# EAGLE design RCJ_com_v2 (EAGLE 9.6.2)
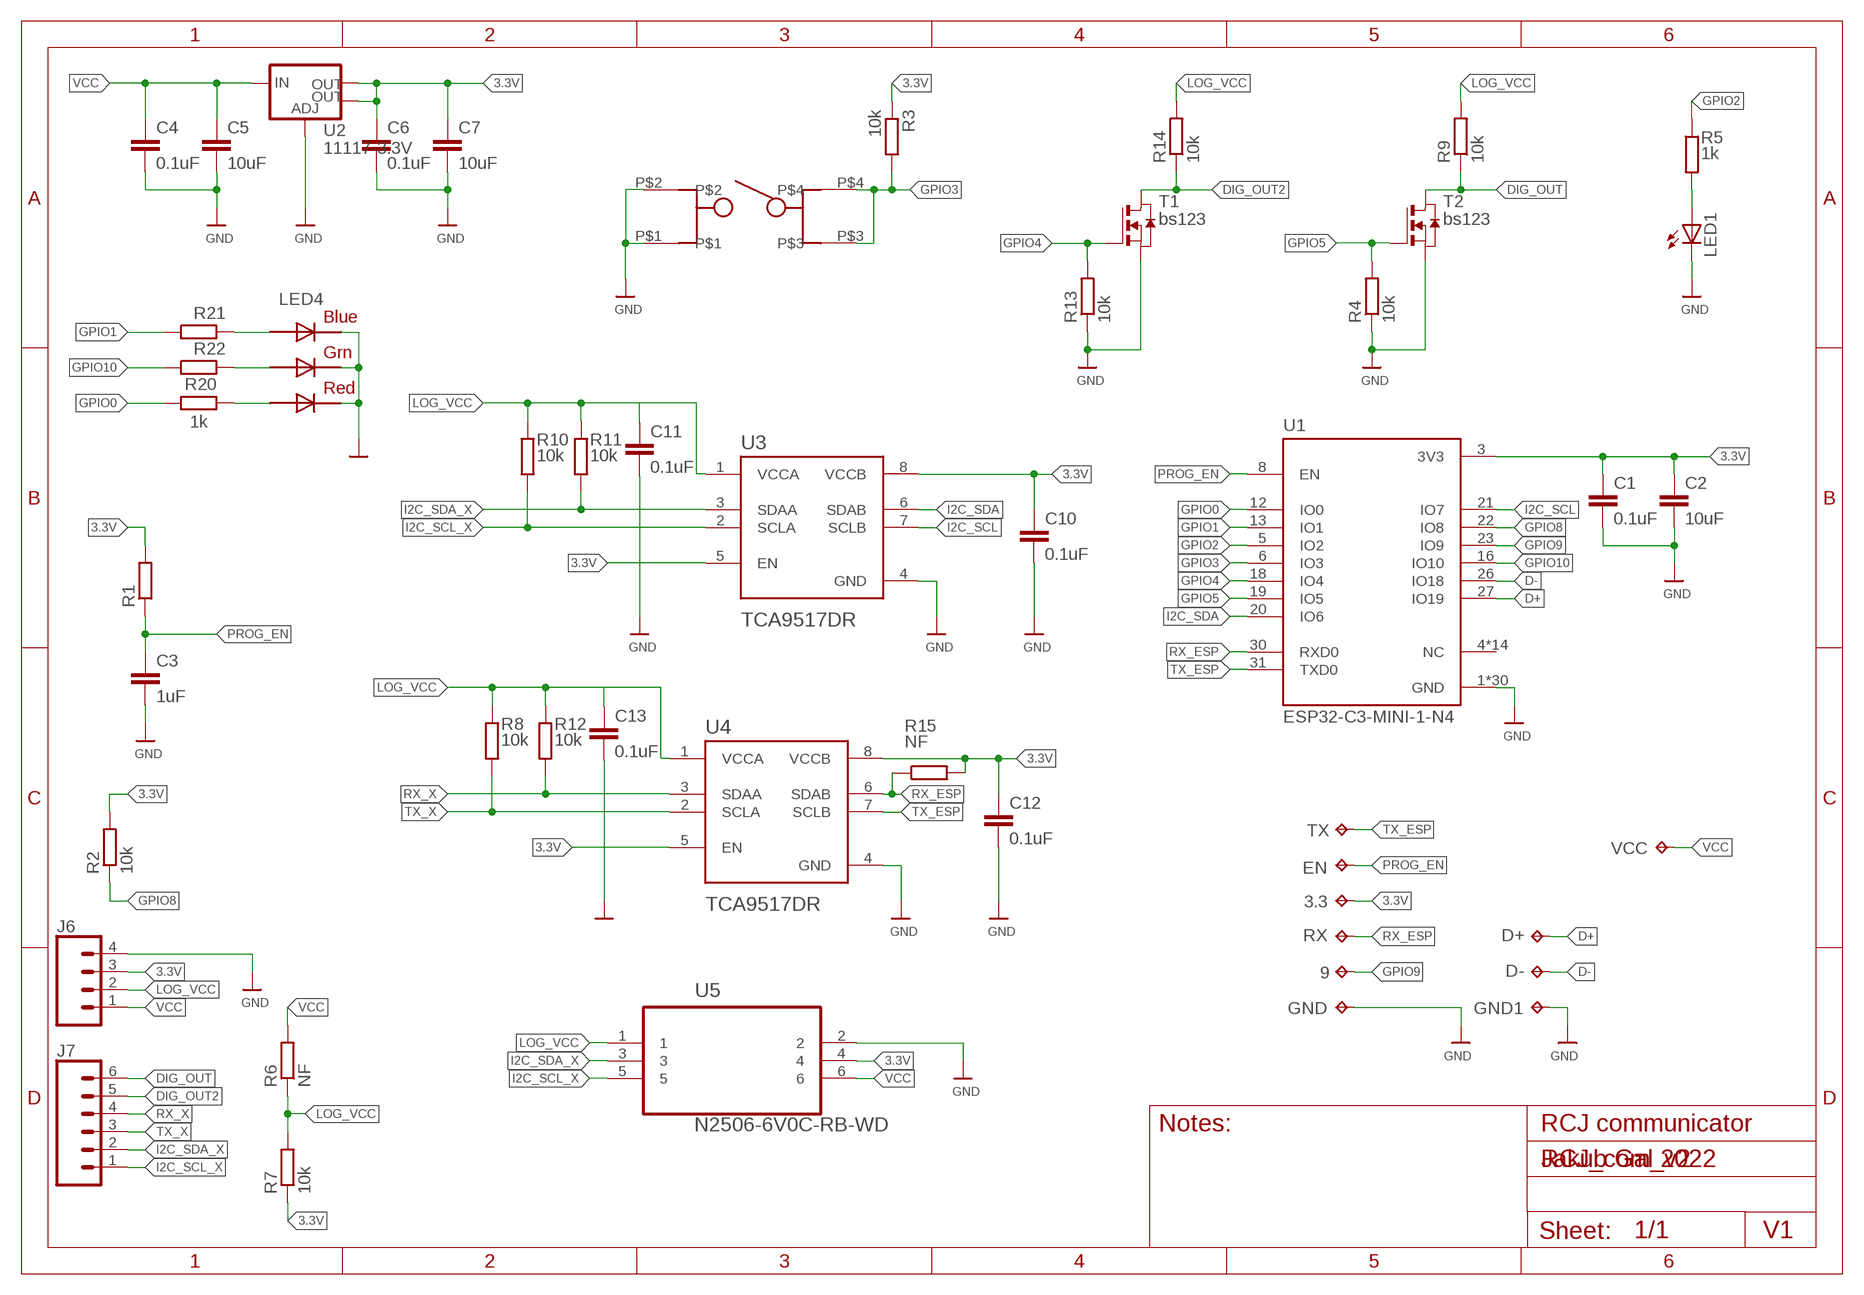
[diagram p0: schematic, sheet 1]

## Parts
3.3  TPTP08R  [TP08R]
9  TPTP08R  [TP08R]
C1  0.1uF  C-EUC0402K  [C0402K]
C2  10uF  C-EUC0402K  [C0402K]
C3  1uF  C-EUC0402K  [C0402K]
C4  0.1uF  C-EUC0402K  [C0402K]
C5  10uF  C-EUC0402K  [C0402K]
C6  0.1uF  C-EUC0402K  [C0402K]
C7  10uF  C-EUC0402K  [C0402K]
C10  0.1uF  C-EUC0402K  [C0402K]
C11  0.1uF  C-EUC0402K  [C0402K]
C12  0.1uF  C-EUC0402K  [C0402K]
C13  0.1uF  C-EUC0402K  [C0402K]
D+  TPTP08R  [TP08R]
D-  TPTP08R  [TP08R]
EN  TPTP08R  [TP08R]
GND  TPTP08R  [TP08R]
GND1  TPTP08R  [TP08R]
J6  CONN_04  [1X04]
J7  CONN_06SILK_FEMALE_PTH  [1X06]
LED1  0603_Led  LEDCHIPLED_0603  [CHIPLED_0603]
LED4  RGBLED5050  [RGBLED5050]
R1  10k  R-EU_R0402  [R0402]
R2  10k  R-EU_R0402  [R0402]
R3  10k  R-EU_R0402  [R0402]
R4  10k  R-EU_R0402  [R0402]
R5  1k  R-EU_R0402  [R0402]
R6  NF  R-EU_R0402  [R0402]
R7  10k  R-EU_R0402  [R0402]
R8  10k  R-EU_R0402  [R0402]
R9  10k  R-EU_R0402  [R0402]
R10  10k  R-EU_R0402  [R0402]
R11  10k  R-EU_R0402  [R0402]
R12  10k  R-EU_R0402  [R0402]
R13  10k  R-EU_R0402  [R0402]
R14  10k  R-EU_R0402  [R0402]
R15  NF  R-EU_R0402  [R0402]
R20  1k  R-EU_R0402  [R0402]
R21  1k  R-EU_R0402  [R0402]
R22  1k  R-EU_R0402  [R0402]
RX  TPTP08R  [TP08R]
T1  bs123  NMOSSOT23  [SOT-23]
T2  bs123  NMOSSOT23  [SOT-23]
TX  TPTP08R  [TP08R]
U1  ESP32-C3-MINI-1-N4  [XCVR_ESP32-C3-MINI-1-N4]
U2  11117-3.3V  V_REG_LM1117SOT223  [SOT223]
U3  TCA9517DR  [SOIC127P599X175-8N]
U4  TCA9517DR  [SOIC127P599X175-8N]
U5  N2506-6V0C-RB-WD  [3M_N2506-6V0C-RB-WD]
U$9  BUTON  [PBUTON_LSCS]
VCC  TPTP08R  [TP08R]

## Nets
3.3V: 3.3.TP C1.1 C2.1 C6.1 C7.1 C10.1 C12.1 J6.3 R1.2 R2.2 R3.1 R7.1 R15.2 U1.3(3V3) U2.2(OUT) U2.4(OUT) U3.5(EN) U3.8(VCCB) U4.5(EN) U4.8(VCCB) U5.4
D+: D+.TP U1.27(IO19)
D-: D-.TP U1.26(IO18)
DIG_OUT: J7.6 R9.1 T2.1(D)
DIG_OUT2: J7.5 R14.1 T1.1(D)
GND: C1.2 C2.2 C3.2 C4.2 C5.2 C6.2 C7.2 C10.2 C11.2 C12.2 C13.2 GND1.TP GND.TP J6.4 LED1.C LED4.4(BLUE_C) LED4.5(RED_C) LED4.6(GREEN_C) R4.1 R13.1 T1.2(S) T2.2(S) U1.1(GND) U1.2(GND) U1.11(GND) U1.14(GND) U1.36(GND) U1.37(GND) U1.38(GND) U1.39(GND) U1.40(GND) U1.41(GND) U1.42(GND) U1.43(GND) U1.44(GND) U1.45(GND) U1.46(GND) U1.47(GND) U1.48(GND) U1.49_1(GND) U1.49_2(GND) U1.49_3(GND) U1.49_4(GND) U1.49_5(GND) U1.49_6(GND) U1.49_7(GND) U1.49_8(GND) U1.49_9(GND) U1.50(GND) U1.51(GND) U1.52(GND) U1.53(GND) U2.1(ADJ) U3.4(GND) U4.4(GND) U5.2 U$9.P$1 U$9.P$2
GPIO0: R20.1 U1.12(IO0)
GPIO1: R21.1 U1.13(IO1)
GPIO2: R5.1 U1.5(IO2)
GPIO3: R3.2 U1.6(IO3) U$9.P$3 U$9.P$4
GPIO4: R13.2 T1.3(G) U1.18(IO4)
GPIO5: R4.2 T2.3(G) U1.19(IO5)
GPIO8: R2.1 U1.22(IO8)
GPIO9: 9.TP U1.23(IO9)
GPIO10: R22.1 U1.16(IO10)
I2C_SCL: U1.21(IO7) U3.7(SCLB)
I2C_SCL_X: J7.1 R10.2 U3.2(SCLA) U5.5
I2C_SDA: U1.20(IO6) U3.6(SDAB)
I2C_SDA_X: J7.2 R11.2 U3.3(SDAA) U5.3
LOG_VCC: C11.1 C13.1 J6.2 R6.1 R7.2 R8.1 R9.2 R10.1 R11.1 R12.1 R14.2 U3.1(VCCA) U4.1(VCCA) U5.1
N$1: LED1.A R5.2
N$2: LED4.3(BLUE_A) R21.2
N$3: LED4.1(GREEN_A) R22.2
N$4: LED4.2(RED_A) R20.2
PROG_EN: C3.1 EN.TP R1.1 U1.8(EN)
RX_ESP: R15.1 RX.TP U1.30(RXD0) U4.6(SDAB)
RX_X: J7.4 R12.2 U4.3(SDAA)
TX_ESP: TX.TP U1.31(TXD0) U4.7(SCLB)
TX_X: J7.3 R8.2 U4.2(SCLA)
VCC: C4.1 C5.1 J6.1 R6.2 U2.3(IN) U5.6 VCC.TP
Unconnected: U1.4(NC) U1.7(NC) U1.9(NC) U1.10(NC) U1.15(NC) U1.17(NC) U1.24(NC) U1.25(NC) U1.28(NC) U1.29(NC) U1.32(NC) U1.33(NC) U1.34(NC) U1.35(NC)

## Notes on the sheet
- Notes: | RCJ communicator
- Jakub Gal 2022
- V1

## Library data of the parts
3.3 9 D+ D- EN GND GND1 RX TX VCC = testpad:TP: Test pad
C1-C7 C10-C13 = rcl:C-EU: CAPACITOR, European symbol; SPICEPREFIX: C
J6 = SparkFun-Connectors:CONN_04: Multi connection point. Often used as Generic Header-pin footprint for 0.1 inch spaced/style header connections On any of the 0.1 inch spaced packages, you can populate with these: Break Away Headers - Straight <https://www.sparkfun.com/products/116> (PRT-00116) Break Away Male Headers - Right Angle <https://www.sparkfun.com/products/553> (PRT-00553) Female Headers <https://www.sparkfun.com/products/115> (PRT-00115) Break Away Headers - Machine Pin <https://www.sparkfun.com/products/117> (PRT-00117) Break Away Female Headers - Swiss Machine Pin <https://www.sparkfun.com/products/743> (PRT-00743) For SCREWTERMINALS and SPRING TERMINALS visit here: Screw Terimnals on SparkFun.com <https://www.sparkfun.com/search/results?term=Screw+Terminals> (5mm/3.5mm/2.54mm spacing) This device is also useful as a general connection point to wire up your design to another part of your project. Our various solder wires solder well into these plated through hole pads. Hook-Up Wire - Assortment (Stranded, 22 AWG) <https://www.sparkfun.com/products/11375> (PRT-11375) Hook-Up Wire - Assortment (Solid Core, 22 AWG) <https://www.sparkfun.com/products/11367> (PRT-11367) View the entire wire category on our website here <https://www.sparkfun.com/categories/141> Special notes: Molex polarized connector foot print use with SKU : PRT-08231 with associated crimp pins and housings. 1MM SMD Version SKU: PRT-10208; PROD_ID: CONN-09696
J7 = SparkFun-Connectors:CONN_06: Multi connection point. Often used as Generic Header-pin footprint for 0.1 inch spaced/style header connections On any of the 0.1 inch spaced packages, you can populate with these: Break Away Headers - Straight <https://www.sparkfun.com/products/116> (PRT-00116) Break Away Male Headers - Right Angle <https://www.sparkfun.com/products/553> (PRT-00553) Female Headers <https://www.sparkfun.com/products/115> (PRT-00115) Break Away Headers - Machine Pin <https://www.sparkfun.com/products/117> (PRT-00117) Break Away Female Headers - Swiss Machine Pin <https://www.sparkfun.com/products/743> (PRT-00743) Arduino Stackable Header - 6 Pin <https://www.sparkfun.com/products/9280> (PRT-09280) For SCREWTERMINALS and SPRING TERMINALS visit here: Screw Terimnals on SparkFun.com <https://www.sparkfun.com/search/results?term=Screw+Terminals> (5mm/3.5mm/2.54mm spacing) This device is also useful as a general connection point to wire up your design to another part of your project. Our various solder wires solder well into these plated through hole pads. Hook-Up Wire - Assortment (Stranded, 22 AWG) <https://www.sparkfun.com/products/11375> (PRT-11375) Hook-Up Wire - Assortment (Solid Core, 22 AWG) <https://www.sparkfun.com/products/11367> (PRT-11367) View the entire wire category on our website here <https://www.sparkfun.com/categories/141>; PROD_ID: CONN-08437
LED1 = audio amplifier example:LED
LED4 = adafruit:RGBLED: For 5050 RGB LEDs, the order of the LEDs may vary from one manufacturer to another!
R1-R15 R20-R22 = rcl:R-EU_: RESISTOR, European symbol; SPICEPREFIX: R
T1 T2 = zetex:NMOSSOT23: MOS FET; OC_FARNELL: unknown; OC_NEWARK: unknown
U1 = ESP32-C3-MINI-1-N4:ESP32-C3-MINI-1-N4: Check availability <https://pricing.snapeda.com/parts/ESP32-C3-MINI-1-N4/Espressif%20Systems/view-part?ref=eda>; AVAILABILITY: In Stock; DESCRIPTION: Bluetooth, WiFi 802.11b/g/n, Bluetooth v5.0 Transceiver Module 2.412GHz ~ 2.484GHz PCB Trace Surface Mount; MF: Espressif Systems; MP: ESP32-C3-MINI-1-N4; PACKAGE: SMD-53 Espressif Systems; PRICE: None; PURCHASE-URL: https://pricing.snapeda.com/search/part/ESP32-C3-MINI-1-N4/?ref=eda
U2 = SparkFun-IC-Power:V_REG_LM1117: Voltage Regulator LM1117 Standard adjustable voltage regulator but in SMD form. Spark Fun Electronics SKU : COM-00595; PROD_ID: VREG-08170
U3 U4 = TCA9517DR:TCA9517DR: Level-shifting I2C bus repeater 8-SOIC -40 to 85 Check availability <https://pricing.snapeda.com/parts/TCA9517DR/Texas%20Instruments/view-part?ref=eda>; AVAILABILITY: In Stock; DESCRIPTION: 2-bit level-translating 400-kHz I2C/SMBus buffer/repeater with powered-off high-impedance; MF: Texas Instruments; MP: TCA9517DR; PACKAGE: SOIC-8 Texas Instruments; PRICE: None; PURCHASE-URL: https://pricing.snapeda.com/search/part/TCA9517DR/?ref=eda
U5 = N2510-6V0C-RB-WD:N2506-6V0C-RB-WD: Header Check availability <https://pricing.snapeda.com/parts/N2510-6V0C-RB-WD/3M/view-part?ref=eda>; AVAILABILITY: In Stock; DESCRIPTION: Connector Header Surface Mount 10 position 0.100 (2.54mm); MF: 3M; MP: N2510-6V0C-RB-WD; PACKAGE: None; PRICE: None; PURCHASE-URL: https://pricing.snapeda.com/search/part/N2510-6V0C-RB-WD/?ref=eda
U$9 = lscs_buton:BUTON

## Board
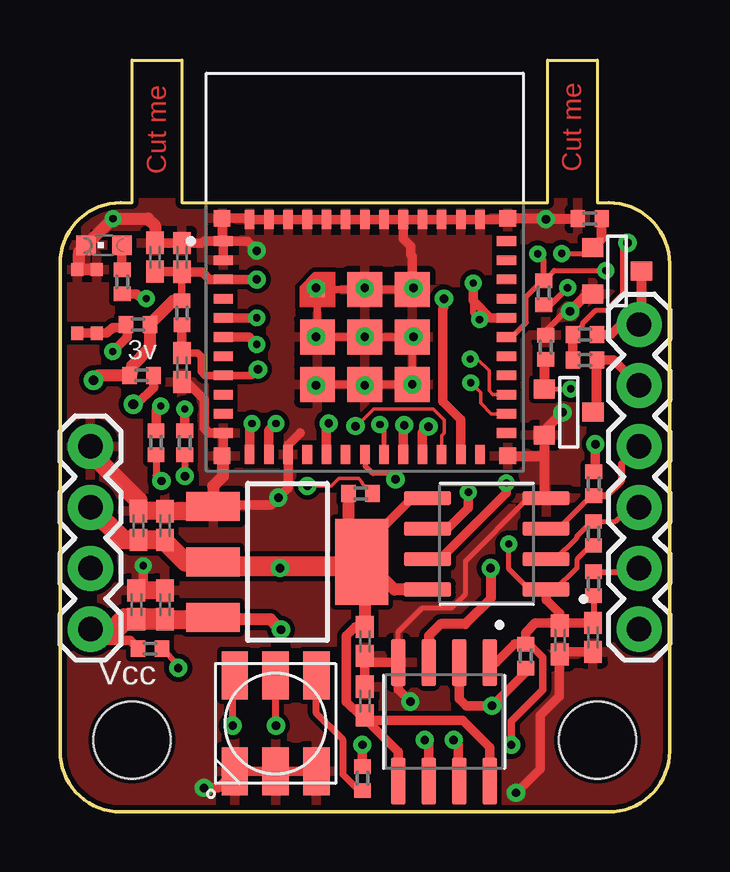
[diagram p1: board, top side]
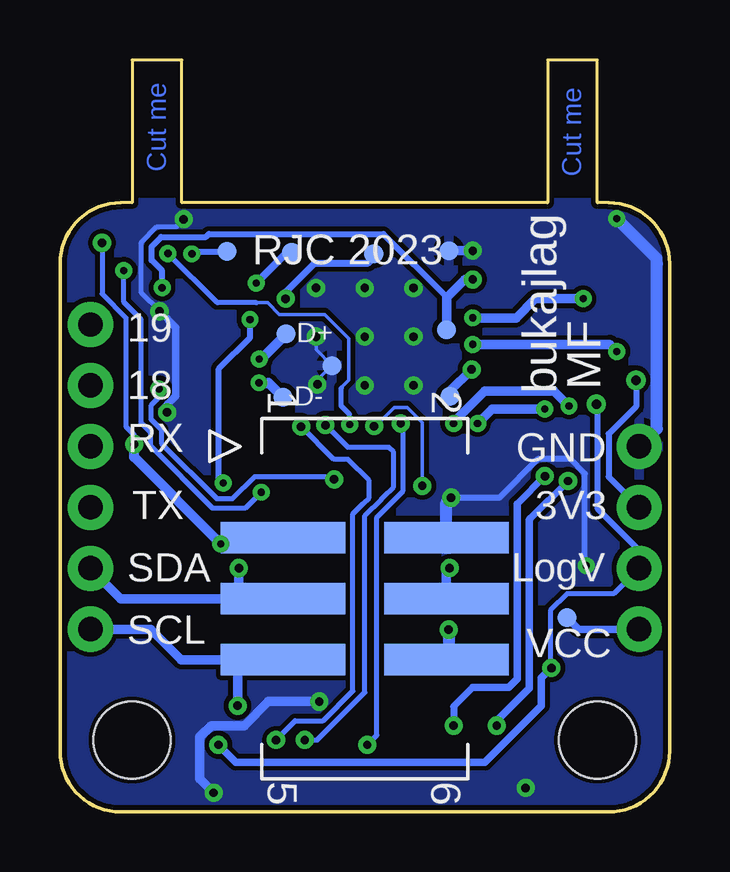
[diagram p2: board, bottom side, seen from below]

Size 25.4 x 31.35 mm. Coordinates in mm from the lower left corner, seen from the top.
Outline: 2.54,0 22.86,0 arc90 25.4,2.54 25.4,22.86 arc90 22.86,25.4 22.39,25.4 22.39,31.35 20.32,31.35 20.32,25.4 5.08,25.4 5.08,31.35 3.01,31.35 3.01,25.4 2.54,25.4 arc90 0,22.86 0,2.54 arc90 2.54,0
Copper layers (1*16): Top 0.035mm / dielectric 1.6mm / Bottom 0.035mm
Design rules "default *": minimum track width 5mil, minimum drill 0.3mm, track to track 0.2mm, track to pad 0.2mm, pad to pad 0.2mm, via to via 0.2mm, smd to smd 0.2mm, copper to edge 0.2mm, drill to drill 0.5mm, minimum pad ring 10mil, minimum via ring 8mil, stop-mask expansion 4mil, vias tented up to drill 0mil, thermal gap 10mil
Holes 3.2 mm at 3,3 22.4,3
tKeepout: area 0,0 to 6,6; area 19.4,0 to 25.4,6

### Footprints (pad centres in the part's own frame; a part is rotated, then mirrored left to right if it is on the bottom)
TP08R = smd 0.8 x 0.8: TP 0,0
C0402K = smd 0.925 x 0.74: 1 -0.6,0; 2 0.6,0
1X04 = drill 1.016 pad 1.88: 1 0,0; 2 2.54,0; 3 5.08,0; 4 7.62,0
1X06 = drill 1.016 pad 1.88: 1 0,0; 2 2.54,0; 3 5.08,0; 4 7.62,0; 5 10.16,0; 6 12.7,0
CHIPLED_0603 = smd 0.8 x 0.8: A 0,-0.75; C 0,0.75
RGBLED5050 = smd 2 x 1.1: 1 -2,1.7; 2 -2,0; 3 -2,-1.7; 4 2,-1.7; 5 2,0; 6 2,1.7
R0402 = smd 0.6 x 0.7: 1 -0.5,0; 2 0.5,0
SOT-23 = smd 0.787 x 0.889: 1 0.025,-1.016; 2 -0.94,1.016; 3 0.991,1.016
XCVR_ESP32-C3-MINI-1-N4 = smd 0.8 x 0.4: 1 -5.9,1.3; 2 -5.9,0.5; 3 -5.9,-0.3; 4 -5.9,-1.1; 5 -5.9,-1.9; 6 -5.9,-2.7; 7 -5.9,-3.5; 8 -5.9,-4.3; 9 -5.9,-5.1; 10 -5.9,-5.9; 11 -5.9,-6.7; 25 5.9,-6.7; 26 5.9,-5.9; 27 5.9,-5.1; 28 5.9,-4.3; 29 5.9,-3.5; 30 5.9,-2.7; 31 5.9,-1.9; 32 5.9,-1.1; 33 5.9,-0.3; 34 5.9,0.5; 35 5.9,1.3 | smd 0.4 x 0.8: 12 -4.8,-7.6; 13 -4,-7.6; 14 -3.2,-7.6; 15 -2.4,-7.6; 16 -1.6,-7.6; 17 -0.8,-7.6; 18 0,-7.6; 19 0.8,-7.6; 20 1.6,-7.6; 21 2.4,-7.6; 22 3.2,-7.6; 23 4,-7.6; 24 4.8,-7.6; 36 4.8,2.2; 37 4,2.2; 38 3.2,2.2; 39 2.4,2.2; 40 1.6,2.2; 41 0.8,2.2; 42 0,2.2; 43 -0.8,2.2; 44 -1.6,2.2; 45 -2.4,2.2; 46 -3.2,2.2; 47 -4,2.2; 48 -4.8,2.2 | smd 0.6 x 0.6: 49_1 -1.975,-0.725 | smd 1.45 x 1.45: 49_2 0,-0.725; 49_3 1.975,-0.725; 49_4 1.975,-2.7; 49_5 1.975,-4.675; 49_6 0,-4.675; 49_7 -1.975,-4.675; 49_8 -1.975,-2.7; 49_9 0,-2.7 | smd 0.7 x 0.7: 50 5.95,2.25; 51 5.95,-7.65; 52 -5.95,-7.65; 53 -5.95,2.25
SOT223 = smd 1.219 x 2.235: 1 -2.311,-3.099; 2 0,-3.099; 3 2.311,-3.099 | smd 3.6 x 2.2: 4 0,3.099
SOIC127P599X175-8N = smd 1.97 x 0.6: 1 -2.47,1.905; 2 -2.47,0.635; 3 -2.47,-0.635; 4 -2.47,-1.905; 5 2.47,-1.905; 6 2.47,-0.635; 7 2.47,0.635; 8 2.47,1.905
3M_N2506-6V0C-RB-WD = smd 1.321 x 5.182: 1 -2.54,-3.404; 2 -2.54,3.404; 3 0,-3.404; 4 0,3.404; 5 2.54,-3.404; 6 2.54,3.404
PBUTON_LSCS = smd 0.5 x 0.55: P$1 0,0; P$2 0.8,0; P$3 0,2.65; P$4 0.8,2.65

### Placement (x,y rotation side)
3.3  9.29,20.11 0 bottom
9  12.33,23.26 0 bottom
C1  3.96,23.12 90 top
C2  5.08,23.11 90 top
C3  5.08,18.53 270 top
C4  4.37,8.64 90 top
C5  3.18,8.64 90 top
C6  4.37,11.94 90 top
C7  3.27,11.94 90 top
C10  12.7,4.62 90 top
C11  20.83,7.17 270 top
C12  12.7,7.11 270 top
C13  22.2,7.28 270 top
D+  15.98,19.93 0 bottom
D-  16.11,17.29 0 bottom
EN  9.16,17.32 0 bottom
GND  9.2,23.4 0 bottom
GND1  14.07,18.61 0 bottom
J6  1.27,7.62 90 top
J7  24.13,7.62 90 top
LED1  1.83,23.62 90 top
LED4  8.98,3.69 270 top
R1  5.08,20.81 90 top
R2  12.53,13.28 180 top
R3  3.25,20.32 180 top
R4  22.07,24.73 0 top
R5  2.59,22.1 90 top
R6  3.75,6.81 180 top
R7  3.4,18.2 0 top
R8  22.23,11.61 90 top
R9  21.87,19.9 180 top
R10  19.4,6.5 270 top
R11  22.23,9.51 90 top
R12  22.24,13.69 270 top
R13  20.24,19.38 270 top
R14  21.87,18.84 180 top
R15  20.16,21.64 270 top
R20  5.2,15.4 270 top
R21  4,15.4 270 top
R22  12.6,1.4 270 top
RX  18.44,23.37 0 bottom
T1  21.19,16.64 90 top
T2  23.21,22.53 90 top
TX  15.74,23.32 0 bottom
U1  12.7,22.5 0 top
U2  9.48,10.42 270 top
U3  16,3.76 270 top
U4  17.78,11.18 180 top
U5  12.7,8.89 270 bottom
U$9  1.52,22.61 180 top
VCC  4.27,8.11 0 bottom

### Tracks (layer width: path | path; a pad name or v marks a point on that pad's centre or on a via)
3.3V  (via drill 0.3, 0.35, 0.4)
  Top 0.254: R15.2 20.44,21.14 v21.15,21.85
  Top 0.305: R1.2 C2.1
  Top 0.4: C1.1 5.07,22.52 C2.1 5.93,22.51 6.25,22.2 U1.3 v8.2,22.2 | R3.1 | U4.5 15.23,13 14.6,13 12.4,10.8 12.4,10.6 | C12.1 12.31,7.71 11.93,7.33 11.93,4.59 12.5,4.02 C10.1 | v9.17,10.17 9.17,10.22 | U3.5 14.1,2.5 12.7,3.9 C10.1 | C10.1 12.9,3.82 16.78,3.82 17.91,2.69 U3.8
  Top 0.5: U4.8 13.93,9.27 12.78,10.42 12.2,10.42 | C12.1 12.7,10.3 U2.4 12.4,10.6 12.03,10.97 R2.2 | v1.4,18 1.6,18.2 R7.1 3,18.3 3,18.6 3.76,19.36 R3.1 | R3.1 3.75,20.35 4.71,21.31 R1.2 4.89,21.31
  Top 0.508: U2.2 12.78,10.42
  Top 0.8: J6.3 2.63,11.34 C7.1 C6.1 4.37,11.27 5.22,10.42 U2.2 6.58,10.22 9.17,10.22 12,10.22 12.2,10.42 U2.4
  Bottom 0.254: v1.4,18 1.4,16.9 2.54,15.77 2.54,13.97 J6.3 | 3.3.TP 9.29,21.46 11.92,24.1 19.2,24.1 19.33,23.97 21.18,23.97 21.58,23.57 21.58,23 21.15,22.57 v21.15,21.85
  Bottom 0.4: U5.4 9.3,10.04 v9.17,10.17 | 3.3.TP 9.29,21.45 8.54,22.2 v8.2,22.2
D+  (via drill 0.3)
  Top 0.152: v17.09,18.88 17.39,18.88 17.88,18.4 17.88,17.56 18.04,17.4 U1.27
  Bottom 0.406: v17.09,18.88 17.02,18.88 D+.TP
D-  (via drill 0.3)
  Top 0.152: U1.26 17.97,16.6 17.52,17.04 17.52,17.48 v17.11,17.89
  Bottom 0.406: v17.11,17.89 16.71,17.89 D-.TP
DIG_OUT
  Top 0.4: R9.1 22.95,19.9 23.37,20.32 J7.6
  Top 0.406: T2.1 24.23,20.42 J7.6
DIG_OUT2
  Top 0.4: R14.1 23.07,18.84 J7.5
  Top 0.406: T1.1 22.37,16.83 R14.1
GND  (via drill 0.3, 0.35)
  Top 0.203: U3.4 14.1,7.5 15.1,8.5 16.3,8.5 16.9,9.1 16.9,10.47 19.51,13.08 U4.4
  Top 0.254: R13.1 20.16,19.96 21.08,20.87 v21.25,20.87
  Top 0.305: U1.49_7 U1.49_6 v14.68,17.82 U1.49_4 U1.49_9 U1.49_8 U1.49_1 U1.49_2 U1.49_3
  Top 0.4: U1.1 6,23.8 5.91,23.71 C2.2 C1.2 | U1.2 U1.1 | U1.1 6.75,23.85 U1.53 7.85,24.75 U1.48 U1.47 U1.46 U1.45 U1.44 U1.43 U1.42 U1.41 U1.40 | U1.40 U1.39 U1.38 U1.37 U1.36 18.6,24.7 U1.50 | U1.52 6.8,14.9 U1.11 6.2,15.8 6,16 6,17.2 5.27,17.93 C3.2 | C10.2 C12.2 12.98,6.23 U3.4 14.1,5.1 v14.6,4.6 | LED4.6 LED4.5 LED4.4 6.6,1 v6,1 | 6.38,12.8 8.8,12.8 v9.1,13.1 9.5,13.5 U1.14 9.5,15.3 10,15.8 | 3.8,9.24 3.79,9.24 3.47,9.56 v3.47,10.27 | C13.2 20.94,6.68 C11.2 20.8,6.54 20.8,4.83 20,4.03 20,1.8 v19,0.8 | U1.40 14.3,23.9 14.61,23.59 14.61,23.24 14.68,23.18 U1.49_3 | U1.1 7.8,23.8 v8.2,23.4
  Top 0.406: U1.50 20.2,24.75 v20.25,24.71 20.27,24.73 R4.1 | v20.94,16.66 20.14,15.86 20.14,15.74 T1.2 20.18,14.9 | 20.18,14.9 20.18,13.15 U4.4 | U1.51 20.13,14.85 20.18,14.9 | v21.25,20.87 21.97,21.59 T2.2
  Top 0.5: C1.2 3.96,24.44 3.66,24.74 v2.21,24.74 LED1.C 0.8,23.34 0.8,22.68 U$9.P$2 U$9.P$1 | 6.38,12.8 U2.1 6.38,13.58 6.8,14 6.8,14.8 U1.52
  Top 0.75: C4.2 3.8,9.24 | 3.79,9.24 C5.2 | U2.1 6.18,12.54 C6.2 C7.2 3.27,12.99 1.27,14.99 J6.4
  Bottom 0.152: v14.68,17.82 14.68,18 GND1.TP 14.73,19.27 v14.73,19.81
  Bottom 0.203: v20.25,24.71 20.56,24.39 21.36,24.39 22.01,23.75 22.01,21.63 v21.25,20.87
  Bottom 0.254: v3.47,10.27 3.53,10.32 3.53,14.09 4.14,14.71 5.49,14.71 7.1,13.1 v9.1,13.1
  Bottom 0.305: v20.94,16.66 20.94,16.98 20.57,17.34 20.57,20.19 v21.25,20.87
  Bottom 0.4: GND.TP 9.2,23.35 9.15,23.4 v8.2,23.4 | v14.6,4.6 16.73,4.6 17.73,3.6 19.1,3.6 19.58,3.12 19.58,1.38 v19,0.8
  Bottom 0.5: J6.4 0.53,15.98 0.53,22.86 0.55,23.08 v2.21,24.74 | U5.2 9.3,12.9 v9.1,13.1
  other vias: 12.7,19.81 14.73,21.84 12.7,21.84 10.67,21.84 10.67,19.81 10.67,17.78 12.7,17.78
  pour Bottom: 0,0 0,25.4 25.4,25.4 25.4,0
  pour Top: 0,0 0,25.4 25.4,25.4 25.4,0
GPIO0  (via drill 0.3)
  Top 0.4: U1.12 7.9,16.1 v8,16.2 | v5.2,16.8 R20.1
  Bottom 0.4: v8,16.2 7.4,16.8 v5.2,16.8
GPIO1  (via drill 0.3)
  Top 0.4: U1.13 8.7,15.9 v9,16.2 | v4.19,16.93 4,16.73 R21.1
  Bottom 0.4: v9,16.2 9,16.27 7.71,17.55 4.82,17.55 v4.19,16.93
GPIO2  (via drill 0.3)
  Top 0.4: U1.5 v8.2,20.6 | v3.6,21.4 3.4,21.4 3.2,21.6 R5.1
  Bottom 0.4: v8.2,20.6 6.4,20.6 5.6,21.4 v3.6,21.4
GPIO3  (via drill 0.3)
  Top 0.4: U$9.P$4 U$9.P$3 1.96,19.96 2.2,20.2 2.63,20.2 R3.2 2.8,20.27 2.8,19.8 v2.2,19.2 | U1.6 7.89,19.8 v8.2,19.49
  Bottom 0.4: v8.2,19.49 2.49,19.49 v2.2,19.2
GPIO4  (via drill 0.3, 0.35)
  Top 0.203: T1.3 v21.27,17.64 v21.28,17.64 | v13.98,13.87 13.74,14.11 13.03,14.11 12.72,14.42 12.72,14.88 U1.18
  Top 0.406: T1.3 20.18,18.82 R13.2
  Bottom 0.203: v21.28,17.64 21.28,17.28 21.62,16.94 21.62,16.38 21.17,15.94 21.17,15.36 18.87,13.06 18.21,13.06 17.29,13.98 14.1,13.98 v13.98,13.87
GPIO5  (via drill 0.3)
  Top 0.203: U1.19 13.5,15.99 v13.33,16.16 | v20.9,23.29 21.96,23.29 T2.3
  Top 0.406: T2.3 22.57,23.9 R4.2
  Bottom 0.152: 13.68,17.69 13.36,18.01 13.36,19.73 14.37,20.74 16.27,20.74 16.75,21.23 17.22,21.23
  Bottom 0.203: v13.33,16.16 13.33,16.57 13.68,16.92 | 13.68,16.92 13.68,16.93 | 13.68,16.92 13.68,17.69 | 17.22,21.23 18.85,21.23 v20.9,23.29
GPIO8  (via drill 0.35)
  Top 0.152: R2.1 12.6,13.7 12.6,13.74 12.44,13.9 11.61,13.9 11.3,13.6 v10.31,13.6 | v12.31,16.09 12.37,16.09 13.07,16.79 15.55,16.79 16.01,16.33 16.01,15.79 15.9,15.68 U1.22
  Bottom 0.152: v10.31,13.6 10.31,16.23 10.93,16.85 11.47,16.85 12.24,16.09 v12.31,16.09
GPIO9  (via drill 0.35)
  Top 0.4: U1.23 16.7,16.36 15.95,17.11 15.95,20.99 16,21.03 v16,21.4
  Bottom 0.3: v16,21.4 16,21.67 14.79,22.88 12.55,22.88 12.33,23.11 9.TP
GPIO10  (via drill 0.35)
  Top 0.4: U1.16 11.1,16.1 v11.2,16.2 | R22.1 v12.6,2.8
  Bottom 0.2: v12.6,2.8 12.2,3.2 12.2,12.29 11.1,13.39 11.1,16.1 v11.2,16.2
I2C_SCL  (via drill 0.35)
  Top 0.4: U3.7 16.6,1.33 16.6,2.8 v16.4,3 | v15.35,16.06 15.1,15.81 U1.21
  Bottom 0.2: v16.4,3 15.6,3.8 14.44,3.8 13.2,5.04 13.2,12.42 12.76,12.86
  Bottom 0.203: 12.76,12.86 12.52,13.1 12.52,13.81 13.41,14.7 13.99,14.7 v15.35,16.06
I2C_SCL_X  (via drill 0.35)
  Top 0.4: U3.2 16.64,4.71 16.92,4.43 v18,4.43 19.4,5.83 R10.2
  Bottom 0.4: v18,4.43 18,6.08 17.73,6.35 U5.5 20.35,6.35 21.62,7.62 J7.1
I2C_SDA  (via drill 0.35)
  Top 0.4: U3.6 15.37,2.83 v15.2,3 | v14.35,16.13 14.3,16.08 U1.20
  Bottom 0.2: 11.86,13.2 11.93,13.13 12,13.05 12.7,12.35 12.7,4.97 14.68,3 v15.2,3
  Bottom 0.203: 11.93,13.13 11.5,13.55 11.5,15 11.7,15.2 13.39,15.2 14.32,16.13 v14.35,16.13
I2C_SDA_X  (via drill 0.35)
  Top 0.254: R11.2 23.98,10.01 J7.2
  Top 0.406: v17.95,10.16 17.95,8.89 16.89,7.83 15.86,7.83 15.37,7.34 U3.3
  Bottom 0.4: v17.95,10.16 17.95,9.07 17.76,8.89 U5.3 22.86,8.89 J7.2
LOG_VCC  (via drill 0.3, 0.35, 0.4)
  Top 0.2: 22.1,11.09 21.54,10.52 21.54,10.16 20.64,9.27 U4.1 19.55,9.27 18.7,10.12 v18.7,11.18
  Top 0.203: R9.2 21.77,20.3 21.77,20.37 22.29,20.89 22.76,20.89 23.44,21.57 23.44,23.51 v23.65,23.72
  Top 0.254: R6.1 4.92,6.14 v4.92,6 | R11.1 22.23,7.91 C13.1
  Top 0.305: 21.31,18.77 R14.2 | v18.8,2.8 18.8,3.78 20.1,5.08 20.1,6.45 19.55,7 R10.1
  Top 0.4: C11.1 20.94,7.88 C13.1 22.26,7.93 | U3.1 18.17,6.23 18.94,7 R10.1 19.4,7.46 19.81,7.87 20.72,7.87 C11.1 | R7.2 3.9,17.7 3.2,17 v3.05,17 | R9.2 R14.2 | v22.31,15.33 22.31,14.26 R12.1 | C11.1 20.83,8.27 20.25,8.85 U4.1
  Top 0.406: 22.1,11.09 22.2,11.09 R8.1
  Bottom 0.2: v18.7,11.18 v18.69,11.18 18.44,11.43 U5.1
  Bottom 0.203: J6.2 2.33,9.1 4.27,9.1 4.97,8.4 4.97,6.15 4.92,6.11 | v22.31,15.33 22.31,15.72 22.65,16.07 22.65,20.6 23.65,21.59 v23.65,23.72
  Bottom 0.254: J6.2 1.27,10.91 2.99,12.63 2.99,16.94 v3.05,17
  Bottom 0.305: v4.92,6 5.34,5.58 5.34,4.42 7.7,2.07 18.07,2.07 v18.8,2.8
  Bottom 0.4: 4.92,6.11 v4.92,6 | 1.27,9.76 J6.2
  Bottom 0.406: v18.7,11.18 22.31,14.79 v22.31,15.33
N$1
  Top 0.4: R5.2 LED1.A
N$2  (via drill 0.35)
  Top 0.3: R21.2 4,14.03 v4.23,13.8 | v7.2,3.6 7.2,5.6 LED4.3
  Bottom 0.3: v4.23,13.8 5.8,12.23 | 7.2,3.8 v7.2,3.6
  Bottom 0.305: 5.8,12.23 5.85,12.18 5.85,5.15 7.2,3.8
N$3
  Top 0.3: LED4.1 10.68,4.12 11.8,3 11.8,1.55 12.46,0.9 R22.2
N$4  (via drill 0.35)
  Top 0.3: R20.2 v5.2,14 | v9,3.6 8.98,3.62 LED4.2
  Bottom 0.3: 8.2,5.2 9,4.4 v9,3.6 | v5.2,14 6.35,12.85
  Bottom 0.305: 6.35,12.85 6.35,5.54 6.7,5.2 8.2,5.2
PROG_EN  (via drill 0.35)
  Top 0.305: C3.1 5.74,19.13 5.88,18.99 5.88,18.35 6.03,18.2 U1.8 8,18.2 v8.25,18.45
  Top 0.4: 5.18,19.2 5.15,19.2 C3.1 R1.1
  Bottom 0.4: v8.25,18.45 9.16,17.54 EN.TP
RX_ESP  (via drill 0.3)
  Top 0.203: U1.30 18.83,19.8 19.43,20.4 19.43,21.49 20.1,22.16 20.14,22.16 | R15.1 20.59,22.57 v22.74,22.57
  Top 0.254: v19.9,23.27 20.14,23.02 20.14,22.16 R15.1
  Top 0.4: U4.6 16.15,11.81 17.02,12.68 v17.02,13.33
  Bottom 0.203: v22.74,22.57 22.74,21.26 22.02,20.54 22.02,16.21 21.63,15.82 21.63,15.25 19.04,12.66 17.69,12.66 v17.02,13.33
  Bottom 0.254: v19.9,23.27 19.8,23.37 RX.TP
RX_X
  Top 0.2: U4.3 20.3,11.76 20.71,11.76 22.1,13.14 22.1,13.19
  Top 0.3: R12.2 22.79,13.19 23.4,13.8 23.4,14.51 J7.4
  Top 0.4: U4.3 20.8,11.81 | R12.2 22.1,13.19
TX_ESP  (via drill 0.3)
  Top 0.254: v17.48,20.53 17.22,20.79 v17.22,22.05
  Top 0.4: U1.31 17.94,20.6 17.22,21.31 v17.22,22.05 | v18.6,13.71 18.6,13.29 15.85,10.54 U4.7
  Bottom 0.254: v18.6,13.71 18.78,13.89 18.78,18.48 17.48,19.77 v17.48,20.53
  Bottom 0.305: v17.22,22.05 15.96,23.32 TX.TP
TX_X
  Top 0.2: J7.3 23.74,12.7 23.15,12.11 R8.2 22.16,12.11 21.54,11.49 21.54,11.43 20.64,10.54 U4.2
  Top 0.4: U4.2 20.83,10.53
VCC  (via drill 0.35)
  Top 0.4: R6.2 2.92,7.15 1.27,7.15 J6.1
  Top 0.5: v9.21,7.6 8.77,8.04 6.31,8.04
  Top 0.8: C4.1 6.31,8.04 U2.3
  Top 0.9: J6.1 2.29,7.62 2.71,8.04 C5.1 C4.1
  Bottom 0.305: VCC.TP 3.78,7.62 J6.1
  Bottom 0.5: U5.6 9.21,6.43 v9.21,7.59 v9.21,7.6

### Text on the board
Top: Cut me | Cut me
Bottom: Cut me | Cut me
tNames: 3v | Vcc
bNames: bukajlag | RJC 2023 | MF | 19 | 18 | GND | RX | 3V3 | TX | LogV | SDA | SCL | VCC